# EAGLE design fujiBLEboard (EAGLE 8.4.3)
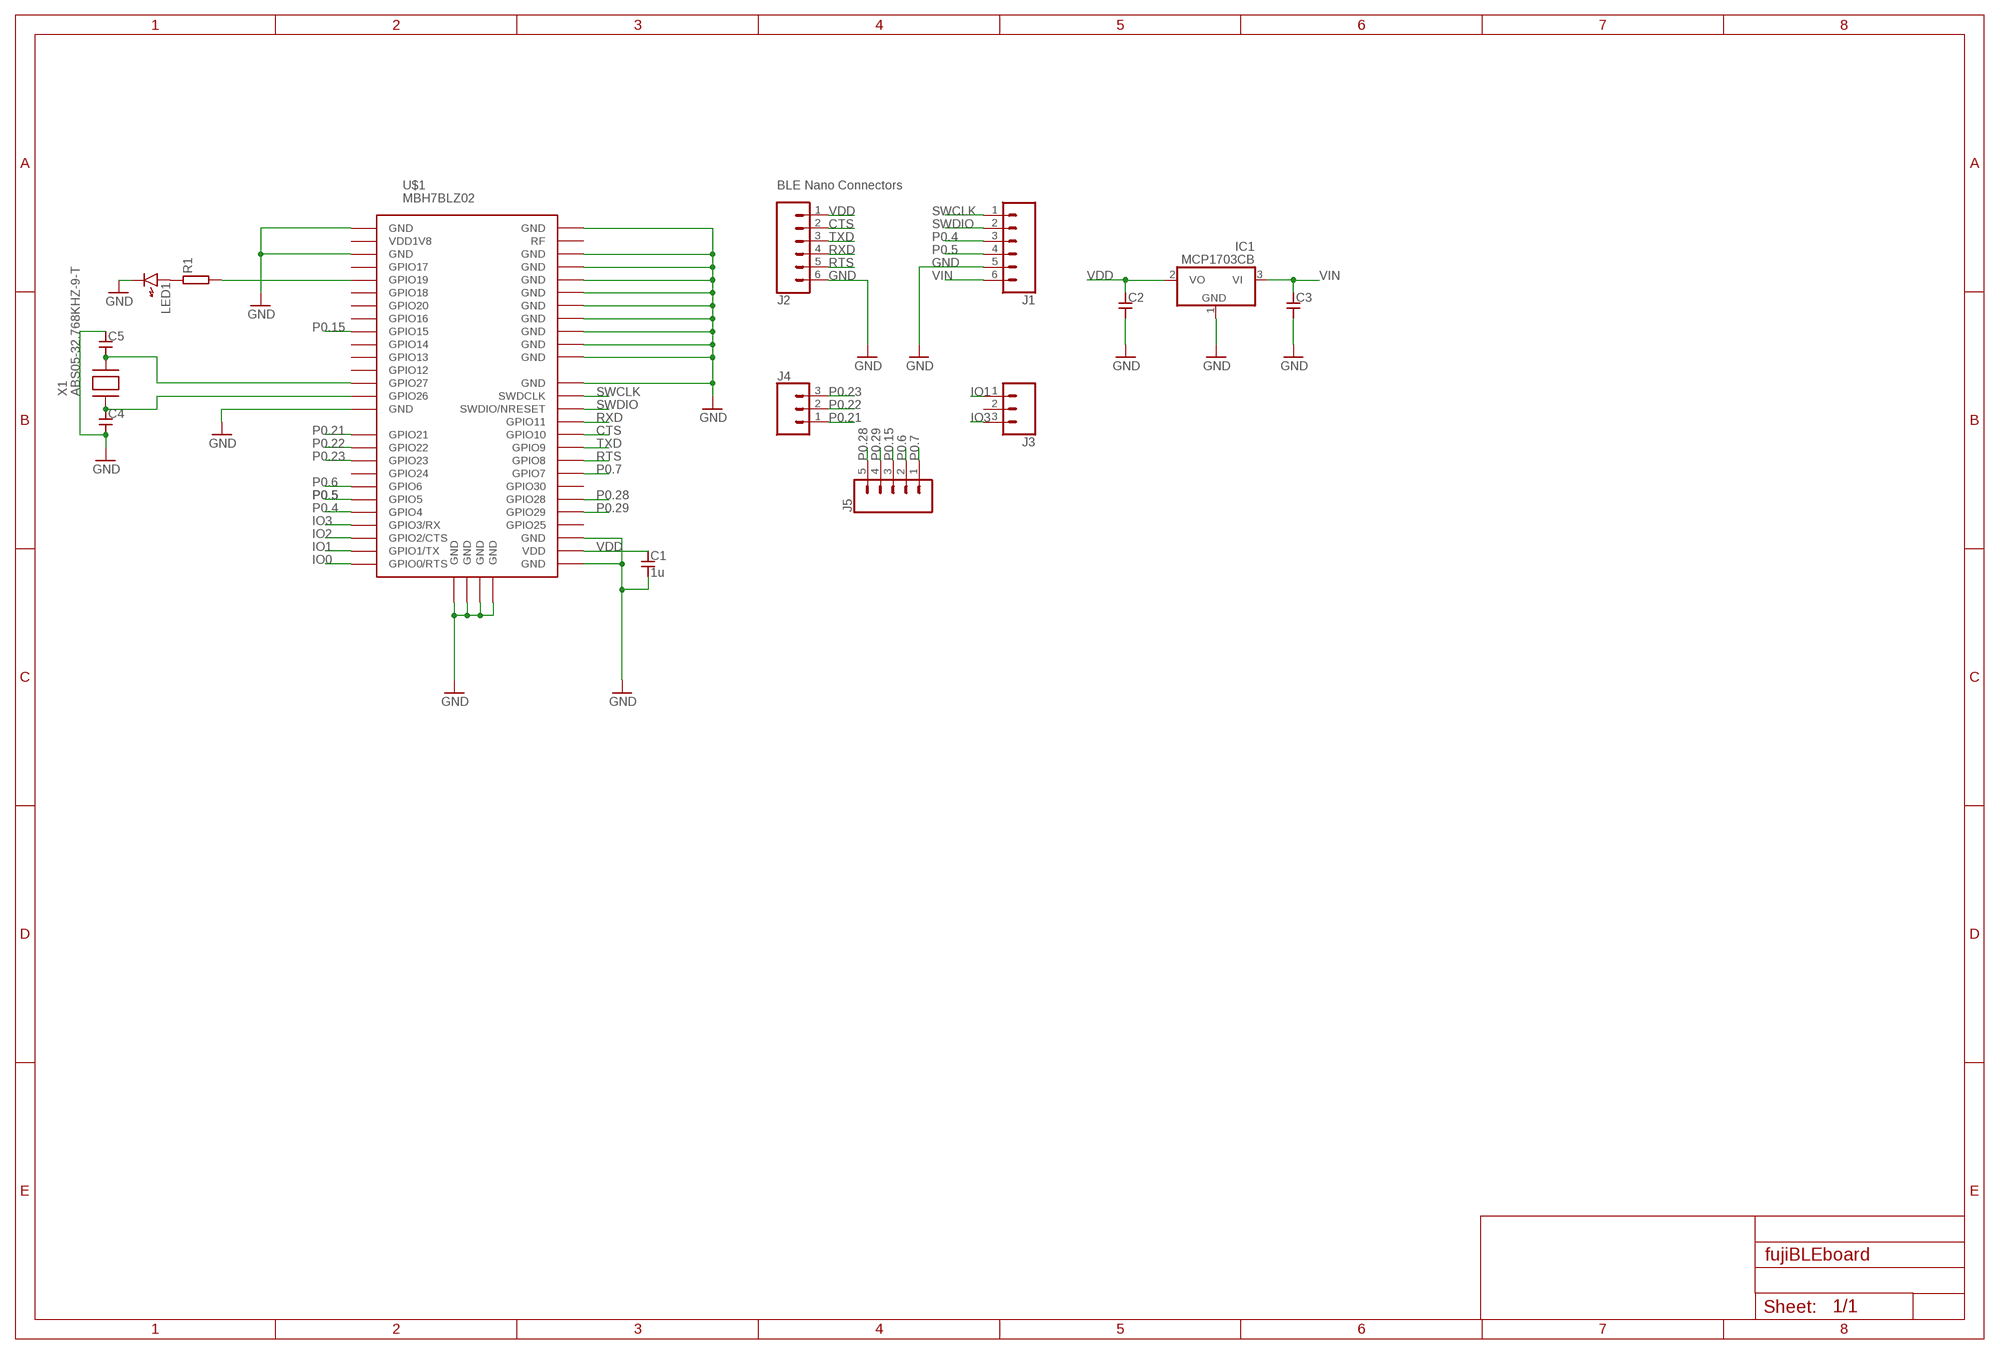
[diagram p0: schematic, sheet 1]

## Parts
C1  1u  CAPACITOR1608_REDUCED  [SMD1608_REDUCED]
C2  CAPACITOR1608_REDUCED  [SMD1608_REDUCED]
C3  CAPACITOR1608_REDUCED  [SMD1608_REDUCED]
C4  CAPACITOR1005  [SMD1005]
C5  CAPACITOR1005  [SMD1005]
IC1  MCP1703CB  [SOT23]
J1  CONN_06NO_SILK_FEMALE_PTH  [1X06_NO_SILK]
J2  CONN_06NO_SILK_FEMALE_PTH  [1X06_NO_SILK]
J3  CONN_031X03_NO_SILK  [1X03_NO_SILK]
J4  CONN_031X03_NO_SILK  [1X03_NO_SILK]
J5  CONN_05NO_SILK  [1X05_NO_SILK]
LED1  LED1608_REDUCED  [LED1608_REDUCED]
R1  RESISTOR1005  [SMD1005]
U$1  MBH7BLZ02  [MBH7BLZ02]
X1  ABS05-32.768KHZ-9-T  [SMD1610]

## Nets
CTS: J2.2 U$1.P$37(GPIO10)
GND: C1.2 C2.2 C3.2 C4.2 C5.1 IC1.1(GND) J1.5 J2.6 LED1.K U$1.P$1(GND) U$1.P$3(GND) U$1.P$15(GND) U$1.P$27(GND) U$1.P$29(GND) U$1.P$41(GND) U$1.P$42(GND) U$1.P$43(GND) U$1.P$44(GND) U$1.P$45(GND) U$1.P$46(GND) U$1.P$47(GND) U$1.P$48(GND) U$1.P$49(GND) U$1.P$50(GND) U$1.P$52(GND) U$1.P$53(GND) U$1.P$54(GND) U$1.P$55(GND) U$1.P$56(GND)
IO0: U$1.P$26(GPIO0/RTS)
IO1: J3.1 U$1.P$25(GPIO1/TX)
IO2: U$1.P$24(GPIO2/CTS)
IO3: J3.3 U$1.P$23(GPIO3/RX)
N$1: LED1.A R1.1
N$2: R1.2 U$1.P$5(GPIO19)
N$6: C4.1 U$1.P$14(GPIO26) X1.1
N$7: C5.2 U$1.P$13(GPIO27) X1.2
P0.4: J1.3 U$1.P$22(GPIO4)
P0.5: J1.4 U$1.P$21(GPIO5)
P0.6: J5.2 U$1.P$20(GPIO6)
P0.7: J5.1 U$1.P$34(GPIO7)
P0.15: J5.3 U$1.P$9(GPIO15)
P0.21: J4.1 U$1.P$16(GPIO21)
P0.22: J4.2 U$1.P$17(GPIO22)
P0.23: J4.3 U$1.P$18(GPIO23)
P0.28: J5.5 U$1.P$32(GPIO28)
P0.29: J5.4 U$1.P$31(GPIO29)
RTS: J2.5 U$1.P$35(GPIO8)
RXD: J2.4 U$1.P$38(GPIO11)
SWCLK: J1.1 U$1.P$40(SWDCLK)
SWDIO: J1.2 U$1.P$39(SWDIO/NRESET)
TXD: J2.3 U$1.P$36(GPIO9)
VDD: C1.1 C2.1 IC1.2(VO) J2.1 U$1.P$28(VDD)
VIN: C3.1 IC1.3(VI) J1.6
Unconnected: J3.2 U$1.P$2(VDD1V8) U$1.P$4(GPIO17) U$1.P$6(GPIO18) U$1.P$7(GPIO20) U$1.P$8(GPIO16) U$1.P$10(GPIO14) U$1.P$11(GPIO13) U$1.P$12(GPIO12) U$1.P$19(GPIO24) U$1.P$30(GPIO25) U$1.P$33(GPIO30) U$1.P$51(RF)

## Notes on the sheet
- BLE Nano Connectors

## Library data of the parts
C1-C5 = generic:CAPACITOR: Generic Capacitor
IC1 = linear:MCP1703: 250 mA, 16V, Low Quiescent Current LDO Regulator Source: http://ww1.microchip.com/downloads/en/DeviceDoc/22049b.pdf
J1 J2 = SparkFun-Connectors:CONN_06: Multi connection point. Often used as Generic Header-pin footprint for 0.1 inch spaced/style header connections On any of the 0.1 inch spaced packages, you can populate with these: Break Away Headers - Straight <https://www.sparkfun.com/products/116> (PRT-00116) Break Away Male Headers - Right Angle <https://www.sparkfun.com/products/553> (PRT-00553) Female Headers <https://www.sparkfun.com/products/115> (PRT-00115) Break Away Headers - Machine Pin <https://www.sparkfun.com/products/117> (PRT-00117) Break Away Female Headers - Swiss Machine Pin <https://www.sparkfun.com/products/743> (PRT-00743) Arduino Stackable Header - 6 Pin <https://www.sparkfun.com/products/9280> (PRT-09280) For SCREWTERMINALS and SPRING TERMINALS visit here: Screw Terimnals on SparkFun.com <https://www.sparkfun.com/search/results?term=Screw+Terminals> (5mm/3.5mm/2.54mm spacing) This device is also useful as a general connection point to wire up your design to another part of your project. Our various solder wires solder well into these plated through hole pads. Hook-Up Wire - Assortment (Stranded, 22 AWG) <https://www.sparkfun.com/products/11375> (PRT-11375) Hook-Up Wire - Assortment (Solid Core, 22 AWG) <https://www.sparkfun.com/products/11367> (PRT-11367) View the entire wire category on our website here <https://www.sparkfun.com/categories/141>; PROD_ID: CONN-08437
J3 J4 = SparkFun-Connectors:CONN_03: Multi connection point. Often used as Generic Header-pin footprint for 0.1 inch spaced/style header connections On any of the 0.1 inch spaced packages, you can populate with these: Break Away Headers - Straight <https://www.sparkfun.com/products/116> (PRT-00116) Break Away Male Headers - Right Angle <https://www.sparkfun.com/products/553> (PRT-00553) Female Headers <https://www.sparkfun.com/products/115> (PRT-00115) Break Away Headers - Machine Pin <https://www.sparkfun.com/products/117> (PRT-00117) Break Away Female Headers - Swiss Machine Pin <https://www.sparkfun.com/products/743> (PRT-00743) Stackable Header - 3 Pin (Female, 0.1") <https://www.sparkfun.com/products/13875> (PRT-13875) For SCREWTERMINALS and SPRING TERMINALS visit here: Screw Terimnals on SparkFun.com <https://www.sparkfun.com/search/results?term=Screw+Terminals> (5mm/3.5mm/2.54mm spacing) This device is also useful as a general connection point to wire up your design to another part of your project. Our various solder wires solder well into these plated through hole pads. Hook-Up Wire - Assortment (Stranded, 22 AWG) <https://www.sparkfun.com/products/11375> (PRT-11375) Hook-Up Wire - Assortment (Solid Core, 22 AWG) <https://www.sparkfun.com/products/11367> (PRT-11367) View the entire wire category on our website here <https://www.sparkfun.com/categories/141> Special notes: Molex polarized connector foot print use with SKU : PRT-08232 with associated crimp pins and housings.
J5 = SparkFun-Connectors:CONN_05: Multi connection point. Often used as Generic Header-pin footprint for 0.1 inch spaced/style header connections On any of the 0.1 inch spaced packages, you can populate with these: Break Away Headers - Straight <https://www.sparkfun.com/products/116> (PRT-00116) Break Away Male Headers - Right Angle <https://www.sparkfun.com/products/553> (PRT-00553) Female Headers <https://www.sparkfun.com/products/115> (PRT-00115) Break Away Headers - Machine Pin <https://www.sparkfun.com/products/117> (PRT-00117) Break Away Female Headers - Swiss Machine Pin <https://www.sparkfun.com/products/743> (PRT-00743) For SCREWTERMINALS and SPRING TERMINALS visit here: Screw Terimnals on SparkFun.com <https://www.sparkfun.com/search/results?term=Screw+Terminals> (5mm/3.5mm/2.54mm spacing) This device is also useful as a general connection point to wire up your design to another part of your project. Our various solder wires solder well into these plated through hole pads. Hook-Up Wire - Assortment (Stranded, 22 AWG) <https://www.sparkfun.com/products/11375> (PRT-11375) Hook-Up Wire - Assortment (Solid Core, 22 AWG) <https://www.sparkfun.com/products/11367> (PRT-11367) View the entire wire category on our website here <https://www.sparkfun.com/categories/141> Special notes: Molex polarized connector foot print use with SKU : PRT-08231 with associated crimp pins and housings. 1MM SMD Version SKU: PRT-10208
LED1 = generic:LED: Generic LEDs
R1 = generic:RESISTOR: Generic Registor
U$1 = MBH7BLZ02:MBH7BLZ02
X1 = SparkFun-Electromechanical:ABS05-32.768KHZ-9-T: ABS05-32.768KHZ-9-T 32.768ｋHz Xtal SMD1610

## Board
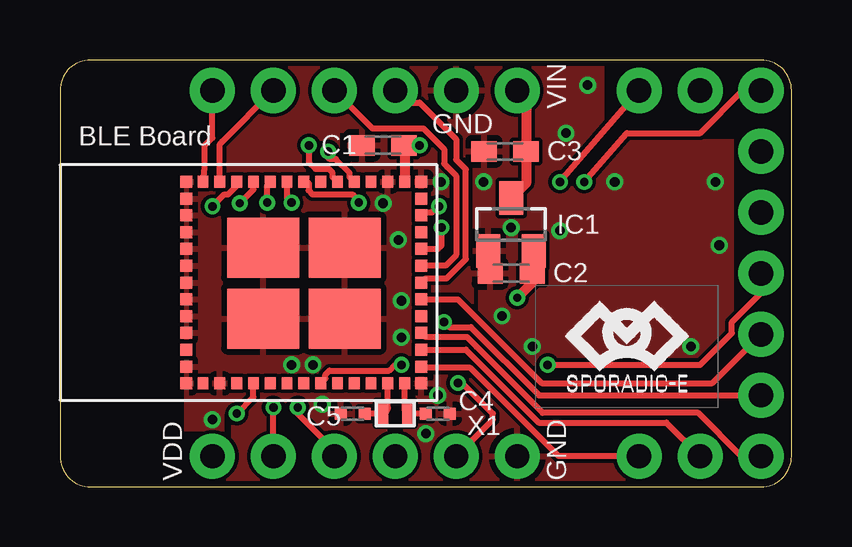
[diagram p1: board, top side]
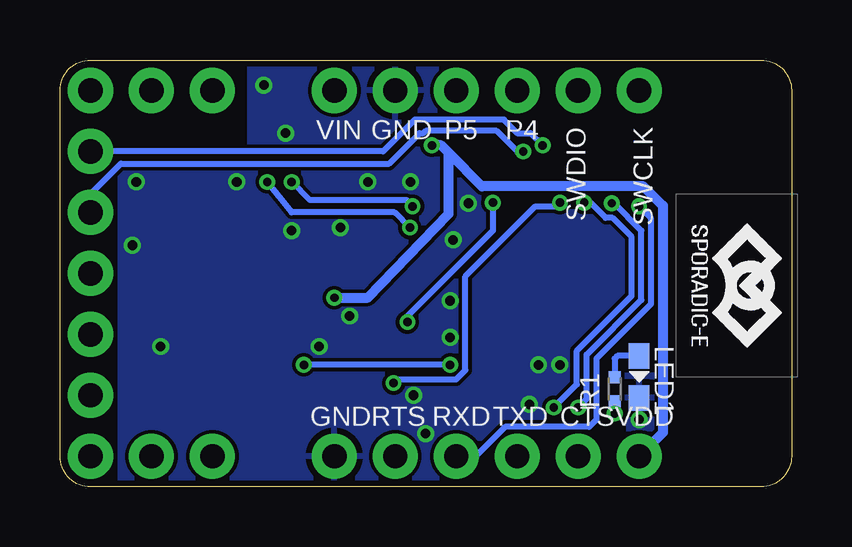
[diagram p2: board, bottom side, seen from below]

Size 30.48 x 17.78 mm. Coordinates in mm from the lower left corner, seen from the top.
Outline: 29.21,17.78 1.27,17.78 arc90 0,16.51 0,1.27 arc90 1.27,0 29.21,0 arc90 30.48,1.27 30.48,16.51 arc90 29.21,17.78
Copper layers (1*16): Top 0.035mm / dielectric 1.5mm / Bottom 0.035mm
Design rules "SeeedStudio_2layer_DRU_no_angle_20140221": minimum track width 6mil, minimum drill 12mil, track to track 6mil, track to pad 6mil, pad to pad 6mil, via to via 6mil, smd to smd 0mil, copper to edge 10mil, drill to drill 10mil, minimum pad ring 10mil, minimum via ring 6mil, stop-mask expansion 2mil, vias tented up to drill 25mil, thermal gap 10mil
tRestrict: area 4.9,5.3 to 5.6,6; area 11.7,14 to 11.9,14.7; area 4.8,13 to 5.6,13.2; area 6.9,2 to 7.1,3; area 4.8,2 to 7.1,2.3; area 17.2,7.4 to 17.4,8.3; area 26.8,14.5 to 30.7,14.6; area 28.1,-1.1 to 28.2,14.6; area 22.7,14.2 to 22.8,18.3
bRestrict: area 22.7,14.2 to 22.8,18.3; area 28.1,-1.1 to 28.2,19.4; area 6.9,2 to 7.1,3

### Footprints (pad centres in the part's own frame; a part is rotated, then mirrored left to right if it is on the bottom)
SMD1608_REDUCED = smd 1.05 x 0.85: 1 -0.875,0; 2 0.875,0
SMD1005 = smd 0.5 x 0.5: 1 -0.5,0; 2 0.5,0
SOT23 = smd 1 x 1.4: 1 -0.95,-1.1; 2 0.95,-1.1; 3 0,1.1
1X06_NO_SILK = drill 1.016 pad 1.88: 1 0,0; 2 2.54,0; 3 5.08,0; 4 7.62,0; 5 10.16,0; 6 12.7,0
1X03_NO_SILK = drill 1.016 pad 1.88: 1 0,0; 2 2.54,0; 3 5.08,0
1X05_NO_SILK = drill 1.016 pad 1.88: 1 0,0; 2 2.54,0; 3 5.08,0; 4 7.62,0; 5 10.16,0
LED1608_REDUCED = smd 1.05 x 0.85: A -0.875,0; K 0.875,0
MBH7BLZ02 = smd 0.5 x 0.5: P$1 -4.9,-4.2; P$15 4.9,-4.2; P$16 4.9,-3.5; P$17 4.9,-2.8; P$18 4.9,-2.1; P$19 4.9,-1.4; P$20 4.9,-0.7; P$21 4.9,0; P$22 4.9,0.7; P$23 4.9,1.4; P$24 4.9,2.1; P$25 4.9,2.8; P$26 4.9,3.5; P$27 4.9,4.2; P$41 -4.9,4.2; P$42 -4.9,3.5; P$43 -4.9,2.8; P$44 -4.9,2.1; P$45 -4.9,1.4; P$46 -4.9,0.7; P$47 -4.9,0; P$48 -4.9,-0.7; P$49 -4.9,-1.4; P$50 -4.9,-2.1; P$51 -4.9,-2.8; P$52 -4.9,-3.5 | smd 0.45 x 0.5: P$2 -4.2,-4.2; P$3 -3.5,-4.2; P$4 -2.8,-4.2; P$5 -2.1,-4.2; P$6 -1.4,-4.2; P$7 -0.7,-4.2; P$8 0,-4.2; P$9 0.7,-4.2; P$10 1.4,-4.2; P$11 2.1,-4.2; P$12 2.8,-4.2; P$13 3.5,-4.2; P$14 4.2,-4.2; P$28 4.2,4.2; P$29 3.5,4.2; P$30 2.8,4.2; P$31 2.1,4.2; P$32 1.4,4.2; P$33 0.7,4.2; P$34 0,4.2; P$35 -0.7,4.2; P$36 -1.4,4.2; P$37 -2.1,4.2; P$38 -2.8,4.2; P$39 -3.5,4.2; P$40 -4.2,4.2 | smd 3 x 2.5: P$53 -1.7,1.45; P$54 -1.7,-1.5; P$55 1.7,-1.5; P$56 1.7,1.45
SMD1610 = smd 0.5 x 1: 1 -0.55,-0.01; 2 0.55,-0.01

### Placement (x,y rotation side)
C1  13.46,14.22 180 top
C2  18.8,8.89 180 top
C3  18.54,13.97 180 top
C4  15.75,3.05 0 top
C5  12.19,3.05 0 top
IC1  18.8,10.92 0 top
J1  6.35,16.51 0 top
J2  6.35,1.27 0 top
J3  24.13,16.51 0 top
J4  24.13,1.27 0 top
J5  29.21,3.81 90 top
LED1  6.35,4.57 270 bottom
R1  7.37,4.06 270 bottom
U$1  10.16,8.51 0 top
U$2  [LOGO-20MM]  23.62,5.84 0 top
U$3  [LOGO-20MM]  2.29,8.38 270 bottom
X1  13.97,3.05 180 top

### Tracks (layer width: path | path; a pad name or v marks a point on that pad's centre or on a via)
CTS  (via drill 0.35)
  Top 0.254: v7.49,11.81 8.06,12.38 U$1.P$37 | J2.2 v8.89,3.3
  Bottom 0.254: v8.89,3.3 8.53,3.66 8.53,5.5 6.25,7.79 6.25,10.67 7.4,11.81 v7.49,11.81
GND  (via drill 0.4 pad 0.4)
  other vias: 15.88,12.7 15.75,3.81 13.46,11.81 6.35,2.79 17.65,12.7 14.1,10.29 14.22,6.22 14.22,7.75 18.8,10.79 18.41,7.11 19.68,5.84 26.29,5.84 27.47,10.06 27.3,12.7 23.11,12.7 20.83,10.67 21.08,14.73 10.92,3.43 10.54,5.08 9.65,5.08 21.98,16.73 15.25,2.21
  pour Top: 5.08,17.78 5.08,0 30.48,0 30.48,17.78
  pour Bottom: 5.08,17.78 5.08,0 30.48,0 30.48,17.53 30.48,17.78
IO1  (via drill 0.35)
  Top 0.254: U$1.P$25 15.18,11.43 15.49,11.43 15.75,11.68 v15.79,11.68 | v20.83,12.7 J3.1
  Bottom 0.254: v15.79,11.68 16.04,11.94 20.07,11.94 v20.83,12.7
IO3  (via drill 0.35)
  Top 0.254: U$1.P$23 15.75,9.91 15.9,10.06 v15.9,10.79 | v21.84,12.7 23.62,14.73 26.67,14.73 28.45,16.51 J3.3
  Bottom 0.254: v15.9,10.79 16.54,11.43 20.83,11.43 v21.84,12.7
N$1
  Bottom 0.254: LED1.A 7.25,5.45 7.37,5.33 R1.1
N$2  (via drill 0.35)
  Top 0.254: v7.37,3.05 8.06,3.74 U$1.P$5
  Bottom 0.254: R1.2 v7.37,3.05
N$6
  Top 0.254: U$1.P$14 14.36,3.22 arc90 X1.1 14.53,3.05 C4.1
N$7
  Top 0.254: U$1.P$13 13.66,3.3 arc-90 X1.2 12.7,3.06 C5.2
P0.4
  Top 0.254: J1.3 13.01,14.93 15.14,14.93 16,14.07 16,13.46 16.13,13.33 16.14,13.33 16.51,12.96 16.51,9.65 16.07,9.21 U$1.P$22
P0.5
  Top 0.254: J1.4 14.48,16 14.99,16 16.51,14.48 16.51,13.62 16.92,13.22 16.92,9.48 16.11,8.68 15.23,8.68 U$1.P$21
P0.6
  Top 0.254: U$1.P$20 16.57,7.81 20.07,4.32 27.18,4.32 J5.2
P0.7  (via drill 0.35)
  Top 0.254: U$1.P$34 10.36,12.66 10.36,12.34 10.52,12.18 12.19,12.18 v12.45,11.84 | v16,6.86 16.21,6.64 17.12,6.64 19.96,3.81 J5.1
  Bottom 0.254: v12.45,11.84 12.45,10.67 16,7.11 v16,6.86
P0.15  (via drill 0.35)
  Top 0.254: v20.32,5.08 26.67,5.08 27.99,6.4 27.99,6.86 29.21,8.07 J5.3 | U$1.P$9 11.06,4.5 11.06,4.67 11.22,4.84 13.72,4.84 13.96,5.08 v14.22,5.08
  Bottom 0.254: v14.22,5.08 v20.32,5.08
P0.21
  Top 0.254: J4.1 20.77,1.27 17.09,4.95 15.12,4.95 U$1.P$16
P0.22
  Top 0.254: U$1.P$17 16.91,5.71 19.95,2.67 25.27,2.67 J4.2
P0.23
  Top 0.254: J4.3 28.39,1.27 26.58,3.08 20.11,3.08 17.44,5.75 | 17.44,5.75 17.35,5.84 | U$1.P$18 15.23,6.24 16.95,6.24 17.44,5.75
P0.28  (via drill 0.35)
  Top 0.254: U$1.P$32 11.36,12.9 11.36,13.07 11.2,13.24 10.64,13.24 10.37,13.51 v10.37,14.22
  Bottom 0.254: J5.5 17.02,13.97 15.7,15.29 11.99,15.29 11.43,14.73 10.88,14.73 v10.37,14.22
P0.29  (via drill 0.35)
  Top 0.254: U$1.P$31 12.06,12.9 12.06,13.07 11.49,13.64 11.25,13.64 11.18,13.72 v11.18,13.97
  Bottom 0.254: J5.4 29.21,12.19 27.94,13.46 16.76,13.46 15.49,14.73 15.34,14.73 15.24,14.83 12.29,14.83 11.43,13.97 v11.18,13.97
RTS  (via drill 0.35)
  Top 0.254: J2.5 18.03,2.79 18.03,3.05 16.76,4.32 v16.58,4.32 | v9.65,11.84 9.46,12.03 U$1.P$35
  Bottom 0.254: v16.58,4.32 16.43,4.47 13.97,4.47 13.59,4.85 13.59,8.76 10.67,11.68 9.91,11.68 9.75,11.84 v9.65,11.84
RXD  (via drill 0.35)
  Top 0.254: v6.35,11.68 6.85,12.18 7,12.18 7.36,12.54 U$1.P$38
  Bottom 0.254: 13.21,1.27 13.15,1.27 | 13.21,1.27 J2.4 | v6.35,11.68 5.85,11.18 5.85,7.62 8.13,5.33 8.13,2.79 8.43,2.49 11.94,2.49 13.15,1.27 | 13.15,1.27 13.21,1.27
SWCLK
  Top 0.254: U$1.P$40 6.03,13.29 6.03,14.22 6.35,14.54 J1.1
SWDIO
  Top 0.254: U$1.P$39 6.66,14.27 6.76,14.37 6.76,14.38 J1.2
TXD  (via drill 0.35)
  Top 0.254: J2.3 11.43,1.52 9.91,3.05 v9.91,3.3 | v8.64,11.84 8.64,12.59 U$1.P$36
  Bottom 0.254: v9.91,3.3 8.94,4.27 8.94,5.67 6.66,7.95 6.66,10.41 7.45,11.21 7.74,11.21 8.37,11.84 v8.64,11.84
VDD  (via drill 0.35)
  Top 0.406: v14.99,14.22 C1.1 arc-90 14.36,14.2 U$1.P$28 | IC1.2 19.75,8.96 C2.1 19.67,8.49 v19.05,7.87
  Bottom 0.406: J2.1 5.36,2.26 5.36,11.71 6.17,12.52 12.9,12.52 14.29,13.91 | 14.29,13.91 14.61,14.22 v14.99,14.22 | v19.05,7.87 17.65,7.87 14.29,11.37 14.29,13.91
VIN
  Top 0.406: J1.6 19.42,16.14 C3.1 19.42,12.64 IC1.3

### Text on the board
tPlace: VIN | GND | BLE Board | VDD | GND
bPlace: SWCLK | SWDIO | P4 | P5 | GND | VIN | VDD | CTS | TXD | RXD | RTS | GND